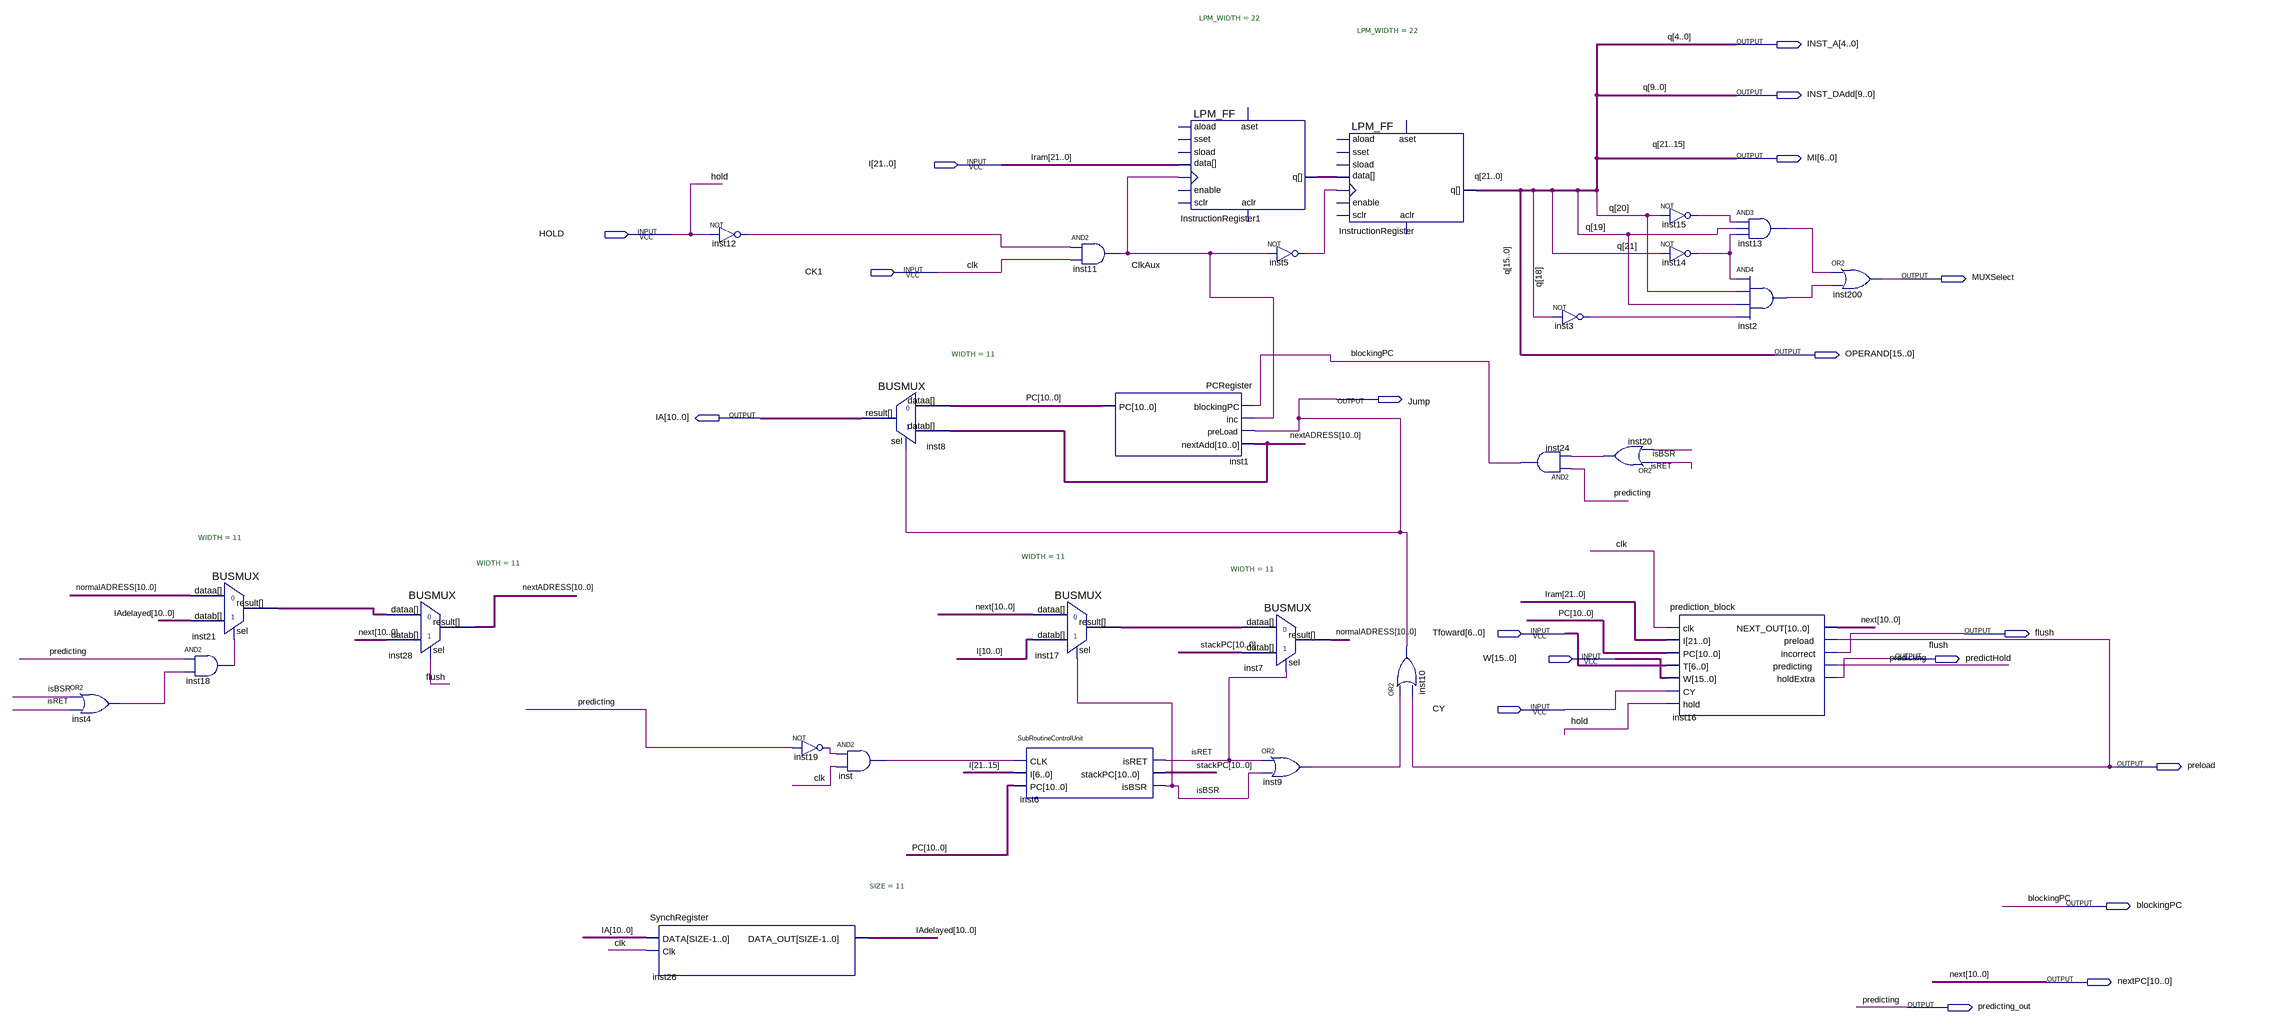
[diagram p0: schematic sheet]
// Quartus schematic fetchUnit.bdf as structural Verilog: 28 symbols, 19 pins
module fetchUnit (
  input  [21:0] I,
  input  HOLD,
  input  CK1,
  input  [6:0] Tfoward,
  input  [15:0] W,
  input  CY,
  output [4:0] INST_A,
  output [9:0] INST_DAdd,
  output [6:0] MI,
  output MUXSelect,
  output [15:0] OPERAND,
  output Jump,
  output [10:0] IA,
  output flush,
  output predictHold,
  output preload,
  output blockingPC,
  output [10:0] nextPC,
  output predicting_out
);

  wire ClkAux, inst2_out, inst3_out, inst4_out, inst5_out, inst9_out, inst12_out, inst13_out, inst14_out,
       inst15_out, inst18_out, inst19_out, inst20_out, inst_out, isBSR, isRET;
  wire [10:0] IAdelayed, inst17_result, inst21_result, nextADRESS, normalADRESS, PC, stackPC;
  wire [21:0] InstructionRegister1_q;

  or inst4 (inst4_out, isBSR, isRET);
  BUSMUX #(.WIDTH(11)) inst21 (.datab(IAdelayed), .sel(inst18_out), .dataa(normalADRESS), .result(inst21_result));
  and inst18 (inst18_out, predicting_out, inst4_out);
  BUSMUX #(.WIDTH(11)) inst28 (.datab(nextPC), .sel(flush), .dataa(inst21_result), .result(nextADRESS));
  SynchRegister #(.SIZE(11)) inst26 (.DATA(IA), .Clk(CK1), .DATA_OUT(IAdelayed));
  not inst12 (inst12_out, HOLD);
  not inst19 (inst19_out, predicting_out);
  BUSMUX #(.WIDTH(11)) inst8 (.datab(nextADRESS), .sel(Jump), .dataa(PC), .result(IA));
  and inst (inst_out, inst19_out, CK1);
  SubRoutineControlUnit inst6 (.CLK(inst_out), .I(I[21:15]), .PC(PC), .isRET(isRET), .stackPC(stackPC), .isBSR(isBSR));
  and inst11 (ClkAux, inst12_out, CK1);
  BUSMUX #(.WIDTH(11)) inst17 (.datab(I[10:0]), .sel(isBSR), .dataa(nextPC), .result(inst17_result));
  PCRegister inst1 (.blockingPC(blockingPC), .inc(ClkAux), .preLoad(Jump), .nextAdd(nextADRESS), .PC(PC));
  LPM_FF #(.LPM_WIDTH(22)) InstructionRegister1 (
    .clock(ClkAux), .data(I), .q(InstructionRegister1_q));  // open: enable, aload, sset, sload, aset, sclr, aclr
  not inst5 (inst5_out, ClkAux);
  BUSMUX #(.WIDTH(11)) inst7 (.datab(stackPC), .sel(isRET), .dataa(inst17_result), .result(normalADRESS));
  or inst9 (inst9_out, isRET, isBSR);
  LPM_FF #(.LPM_WIDTH(22)) InstructionRegister (
    .clock(inst5_out), .data(InstructionRegister1_q), .q({MI, OPERAND[14:10], INST_DAdd[9:5], INST_A}));  // open: enable, aload, sset, sload, aset, sclr, aclr
  or inst10 (Jump, inst9_out, preload);
  and inst24 (blockingPC, predicting_out, inst20_out);
  not inst3 (inst3_out, MI[3]);
  or inst20 (inst20_out, isRET, isBSR);
  not inst15 (inst15_out, MI[5]);
  not inst14 (inst14_out, MI[6]);
  prediction_block inst16 (
    .clk(CK1), .I(I), .PC(PC), .T(Tfoward), .W(W), .CY(CY), .hold(HOLD), .NEXT_OUT(nextPC),
    .preload(preload), .incorrect(flush), .predicting(predicting_out), .holdExtra(predictHold));
  and inst13 (inst13_out, inst15_out, MI[4], inst14_out);
  and inst2 (inst2_out, inst14_out, MI[5], MI[4], inst3_out);
  or inst200 (MUXSelect, inst13_out, inst2_out);

  assign INST_DAdd[4:0] = INST_A;
  assign {OPERAND[15], OPERAND[9:0]} = {MI[0], INST_DAdd[9:5], INST_A};

  // Other names for the same wires on the sheet: clk = CK1; Iram[21:0] = I; next[10:0] = nextPC;
  //   predicting = predicting_out; q[21:0] = {MI, OPERAND[14:10], INST_DAdd[9:5], INST_A}
endmodule
